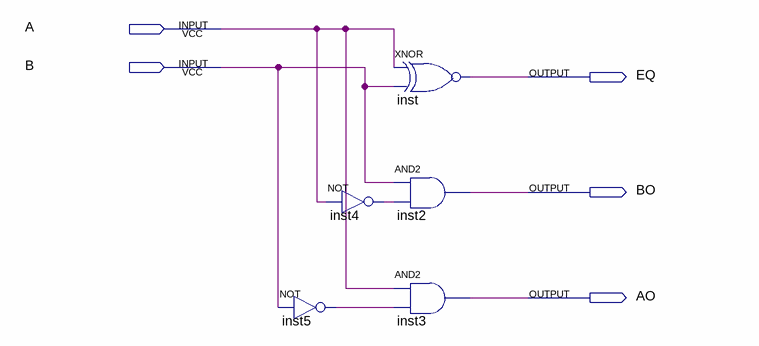
[diagram p0: schematic sheet]
// Quartus schematic 1BitCMP.bdf as structural Verilog: 5 symbols, 5 pins
module \1BitCMP  (
  input  A,
  input  B,
  output EQ,
  output BO,
  output AO
);

  wire inst4_out, inst5_out;

  not inst4 (inst4_out, A);
  not inst5 (inst5_out, B);
  xnor inst (EQ, A, B);
  and inst2 (BO, B, inst4_out);
  and inst3 (AO, A, inst5_out);
endmodule
